# Altium schematic sheet Sensors.SchDoc
size A4; SheetNumber: 1; SheetTotal: 1
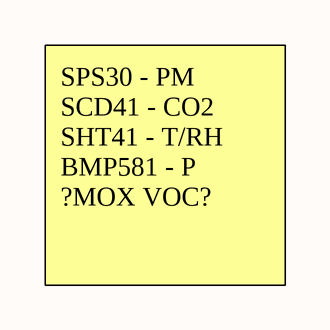
[diagram p0: Sensors.SchDoc]

## Notes on the sheet
- SPS30 - PM
  SCD41 - CO2
  SHT41 - T/RH
  BMP581 - P
  ?MOX VOC?